# Altium schematic sheet High-Side Driver.SchDoc
size A4; SheetNumber: 5; SheetTotal: 8
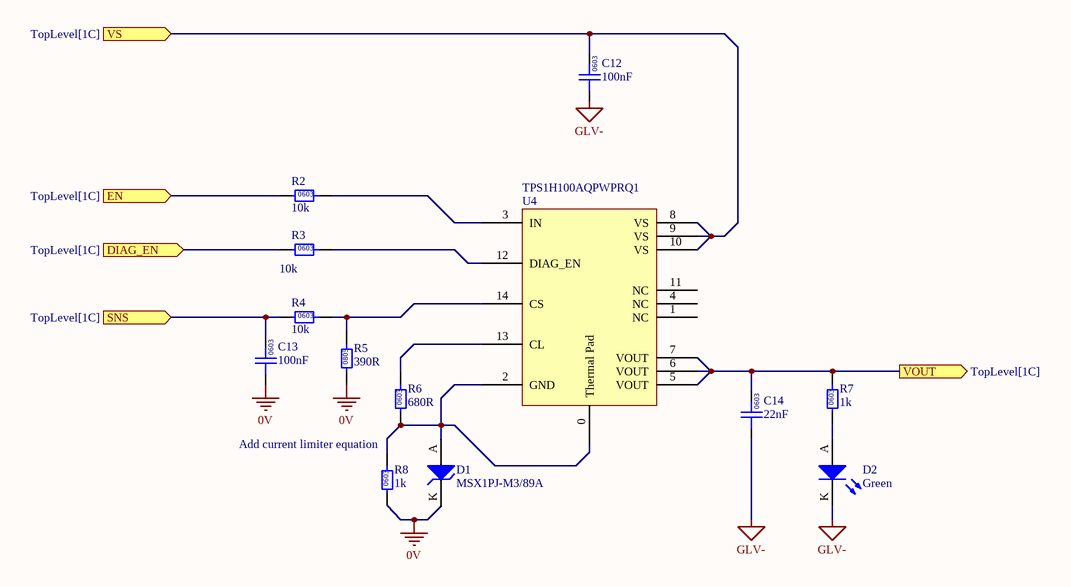
[diagram p0: High-Side Driver.SchDoc]

## Parts
C12  100nF  [0603]
C13  100nF  [0603]
C14  22nF  [0603]
D1  MSX1PJ-M3/89A  [VISHAY DO-219]
D2  Green  [0805 LED]
R2  10k  [0603]
R3  10k  [0603]
R4  10k  [0603]
R5  390R  [0805]
R6  680R  [0603]
R7  1k  [0603]
R8  1k  [0603]
U4  TPS1H100AQPWPRQ1  [TI_14_TSSOP]

## Ports
DIAG_EN (in, see TopLevel[1C]), EN (in, see TopLevel[1C]), SNS (in, see TopLevel[1C]), VOUT (out, see TopLevel[1C]), VS (in, see TopLevel[1C])

## Nets
0V: C13.1 D1.K R5.1 R8.1
GLV-: C12.1 C14.1 D2.K
DIAG_EN: R3.1 ; port DIAG_EN
EN: R2.1 ; port EN
SNS: C13.2 R4.1 ; port SNS
VOUT: C14.2 R7.2 U4.5(VOUT) U4.6(VOUT) U4.7(VOUT) ; port VOUT
VS: C12.2 U4.8(VS) U4.9(VS) U4.10(VS) ; port VS
NetD1_A: D1.A R6.1 R8.2 U4.0(Thermal_Pad) U4.2(GND)
NetD2_A: D2.A R7.1
NetR2_2: R2.2 U4.3(IN)
NetR3_2: R3.2 U4.12(DIAG_EN)
NetR4_2: R4.2 R5.2 U4.14(CS)
NetR6_2: R6.2 U4.13(CL)

Not connected (* = marked no-connect by the designer): U4 1(NC) 4(NC) 11(NC)

## Notes on the sheet
- (near R8) Add current limiter equation
- (in symbol GCM188L81H104KA57D) 0603
- (in symbol GCM188R71H223KA37J) 0603
- (in symbol RC0603FR-071KL) 0603
- (in symbol RC0603FR-0710KL) 0603
- (in symbol RC0603JR-13680RL) 0603
- (in symbol RC0805FR07390RL) 0805

## Library data of the parts
C12 C13 = GCM188L81H104KA57D: Manufacturer: muRata; Rated Voltage: 50V; Tolerance: ±10%; Material: MLCC; Temperature Rating: X8L; Part Number: GCM188L81H104KA57D; Value: 100nF; Digikey Part Number: 490-6049-1-ND
C14 = GCM188R71H223KA37J: Manufacturer: Murata Electronics; Rated Voltage: 50V; Tolerance: ±10%; Material: MLCC; Temperature Rating: X7R; Part Number: GCM188R71H223KA37J; Value: 22nF; Digikey Part Number: 490-8022-2-ND
D1 = MSX1PJ-M3/89A: Manufacturer: Vishay General Semiconductor - Diodes Division; Breakdown Voltage: 600V; Part Number: MSX1PJ-M3/89A
D2 = SML-210FTT86: Green LED Indication - Discrete 1.75V 0805 (2012 Metric); Manufacturer: ROHM Semiconductor; Part Number: SML-210FTT86; Colour: Green; Digikey Part Number: 511-1285-1-ND
R2-R4 = RC0603FR-0710KL: Manufacturer: YAGEO; Tolerance: 0.01; Rated Power: 0.1W; Part Number: RC0603FR-0710KL; Value: 10k; Material: FR-07; Digikey Part Number: 311-10.0KHRCT-ND
R5 = RC0805FR07390RL: Manufacturer: YAGEO; Tolerance: 0.01; Rated Power: 0.125W; Part Number: RC0805FR07390RL; Value: 390R; Material: FR-07; Digikey Part Number: 311-390CRCT-ND
R6 = RC0603JR-13680RL: Manufacturer: YAGEO; Tolerance: 0.01; Rated Power: 0.1W; Part Number: RC0603JR-13680RL; Value: 680R; Material: FR-07; Digikey Part Number: 13-RC0603JR-13680RLCT-ND
R7 R8 = RC0603FR-071KL: Manufacturer: YAGEO; Tolerance: 0.01; Rated Power: 0.1W; Part Number: RC0603FR-071KL; Value: 1k; Material: FR-07; Digikey Part Number: 311-1.00KHRCT-ND
U4 = TPS1H100AQPWPRQ1: IC PWR SWTCH N-CHAN 1:1 14HTSSOP; Manufacturer: Texas Instruments; Complex IC: 1; Part Number: TPS1H100AQPWPRQ1